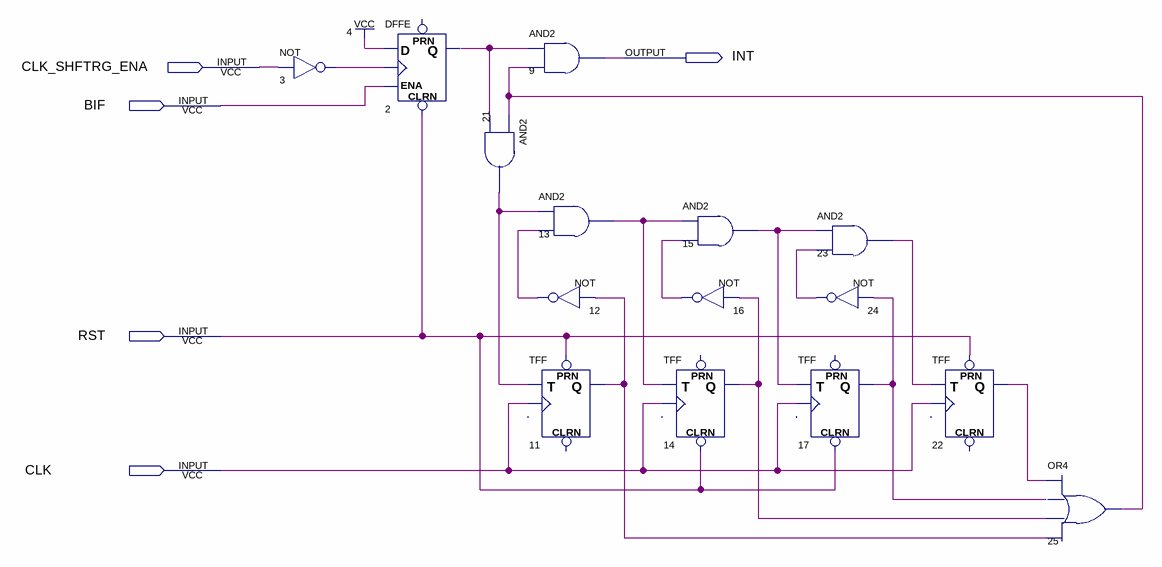
[diagram p0: schematic sheet]
// Quartus schematic cpu_int_form2.bdf as structural Verilog: 15 symbols, 5 pins
module cpu_int_form2 (
  input  CLK_SHFTRG_ENA,
  input  BIF,
  input  RST,
  input  CLK,
  output INT
);

  wire n2_q, n3_out, n11_q, n12_out, n13_out, n14_q, n15_out, n16_out, n17_q, n21_out, n22_q, n23_out,
       n24_out, n25_out;

  not u_3 (n3_out, CLK_SHFTRG_ENA);
  DFFE u_2 (.CLRN(RST), .D(1'b1), .CLK(n3_out), .ENA(BIF), .Q(n2_q));  // open: PRN
  and u_9 (INT, n2_q, n25_out);
  and u_21 (n21_out, n25_out, n2_q);
  and u_13 (n13_out, n21_out, n12_out);
  not u_12 (n12_out, n11_q);
  TFF u_11 (.PRN(RST), .T(n21_out), .CLK(CLK), .Q(n11_q));  // open: CLRN
  and u_15 (n15_out, n13_out, n16_out);
  not u_16 (n16_out, n14_q);
  TFF u_14 (.CLRN(RST), .T(n13_out), .CLK(CLK), .Q(n14_q));  // open: PRN
  and u_23 (n23_out, n15_out, n24_out);
  not u_24 (n24_out, n17_q);
  TFF u_17 (.CLRN(RST), .T(n15_out), .CLK(CLK), .Q(n17_q));  // open: PRN
  TFF u_22 (.PRN(RST), .T(n23_out), .CLK(CLK), .Q(n22_q));  // open: CLRN
  or u_25 (n25_out, n22_q, n17_q, n14_q, n11_q);
endmodule
